# Altium project STM32F103Mini.PrjPcb
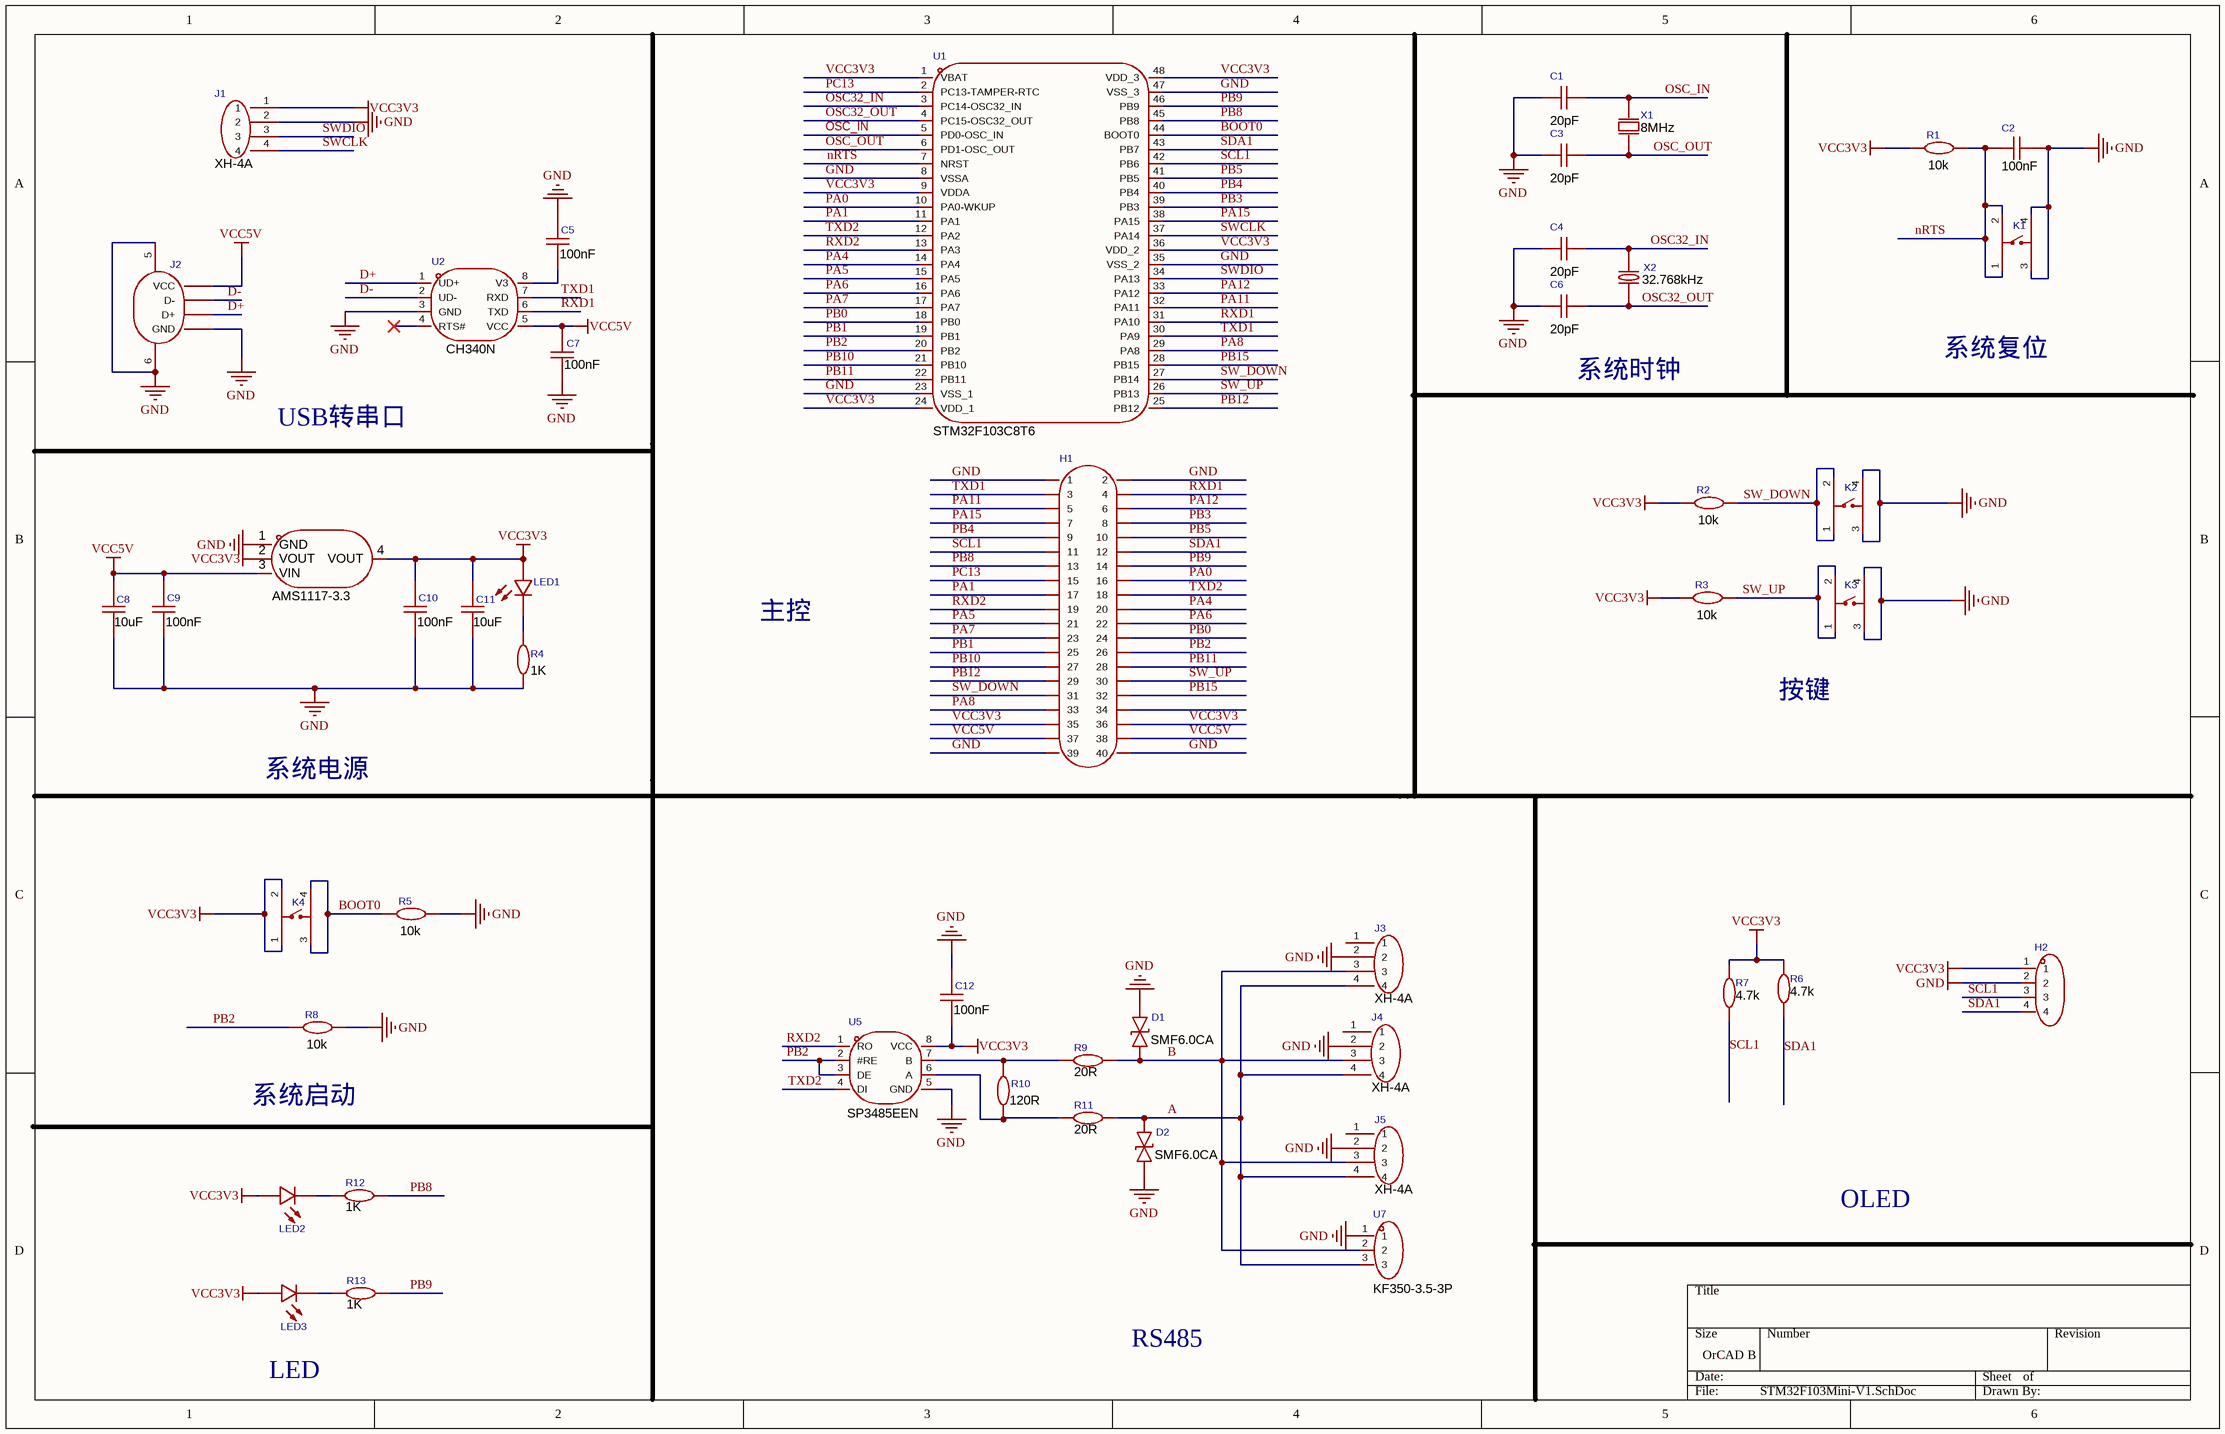
[diagram p0: STM32F103Mini-V1.SchDoc]
1 sheet, 48 parts. Net scope: global (net labels, ports and power ports of the same name join across sheets).
Board file: STM32F103Mini-260711.PcbDoc

## Sheet STM32F103Mini-V1.SchDoc
size OrCAD B; SheetNumber: 1; SheetTotal: 1

### Parts
C1  20pF  [C0603]
C2  100nF  [C0603]
C3  20pF  [C0603]
C4  20pF  [C0603]
C5  100nF  [C0603]
C6  20pF  [C0603]
C7  100nF  [C0603]
C8  10uF  [C0805]
C9  100nF  [C0603]
C10  100nF  [C0603]
C11  10uF  [C0805]
C12  100nF  [C0603]
D1  SMF6.0CA  [SOD-123FL_L2.8-W1.8-LS3.7-BI]
D2  SMF6.0CA  [SOD-123FL_L2.8-W1.8-LS3.7-BI]
H1  2.54mm 2*20p直排针  [HDR-TH_40P-P2.54-V-M-R2-C20-S2.54]  (value not drawn)
H2  pm254v-11-04-h85  [HDR-TH_4P-P2.54-V-F]  (value not drawn)
J1  XH-4A  [CONN-TH_4P-P2.50_XH-4A]
J2  921-111a1010d10200  [USB-B_TH_USB-B-FEMALE-90]  (value not drawn)
J3  XH-4A  [CONN-TH_4P-P2.50_XH-4A]
J4  XH-4A  [CONN-TH_4P-P2.50_XH-4A]
J5  XH-4A  [CONN-TH_4P-P2.50_XH-4A]
K1  kh-6x6x5h-stm  [SW-SMD_4P-L6.0-W6.0-P4.50-LS9.0_H5.0]  (value not drawn)
K2  kh-6x6x5h-stm  [SW-SMD_4P-L6.0-W6.0-P4.50-LS9.0_H5.0]  (value not drawn)
K3  kh-6x6x5h-stm  [SW-SMD_4P-L6.0-W6.0-P4.50-LS9.0_H5.0]  (value not drawn)
K4  kh-6x6x5h-stm  [SW-SMD_4P-L6.0-W6.0-P4.50-LS9.0_H5.0]  (value not drawn)
LED1  ncd0603c1  [LED0603-RD]  (value not drawn)
LED2  ncd0603c1  [LED0603-RD]  (value not drawn)
LED3  ncd0603c1  [LED0603-RD]  (value not drawn)
R1  10k  [R0603]
R2  10k  [R0603]
R3  10k  [R0603]
R4  1K  [R0603]
R5  10k  [R0603]
R6  4.7k  [R0603]
R7  4.7k  [R0603]
R8  10k  [R0603]
R9  20R  [R0805]
R10  120R  [R0603]
R11  20R  [R0805]
R12  1K  [R0603]
R13  1K  [R0603]
U1  STM32F103C8T6  [LQFP-48_L7.0-W7.0-P0.50-LS9.0-BL]
U2  CH340N  [SOP-8_L4.9-W3.9-P1.27-LS6.0-BL]
U5  SP3485EEN  [SOP-8_L5.0-W4.0-P1.27-LS6.0-BL]
U7  KF350-3.5-3P  [CONN-TH_3P-P3.50_KF350-3.5-3P]
X1  8MHz  [CRYSTAL-SMD_L5.0-W3.2]
X2  32.768kHz  [FC-135R_L3.2-W1.5]
  AMS1117-3.3  [SOT-223-3_L6.5-W3.4-P2.30-LS7.0-BR]

### Nets
GND: C1.1 C2.1 C3.1 C4.1 C5.2 C6.1 C8.1 C9.1 C10.1 C11.1 C12.2 D1.2 D2.1 H1.1 H1.2 H1.39 H1.40 H2.2 J1.2 J2.4(GND) J2.5(SH1) J2.6(SH2) J3.2 J4.2 J5.2 K1.3 K1.4 K2.3 K2.4 K3.3 K3.4 R4.1 R5.2 R8.2 U1.8(VSSA) U1.23(VSS_1) U1.35(VSS_2) U1.47(VSS_3) U2.3(GND) U5.5(GND) U7.1 .1(GND)
VCC3V3: C10.2 C11.2 C12.1 H1.35 H1.36 H2.1 J1.1 K4.1 K4.2 LED1.2(+) LED2.2(+) LED3.2(+) R1.1 R2.1 R3.1 R6.2 R7.2 U1.1(VBAT) U1.9(VDDA) U1.24(VDD_1) U1.36(VDD_2) U1.48(VDD_3) U5.8(VCC) .2(VOUT) .4(VOUT)
VCC5V: C7.1 C8.2 C9.2 H1.37 H1.38 J2.1(VCC) U2.5(VCC) .3(VIN)
A: D2.2 J3.4 J4.4 J5.4 R11.1 U7.3
B: D1.1 J3.3 J4.3 J5.3 R9.1 U7.2
BOOT0: K4.3 K4.4 R5.1 U1.44(BOOT0)
D+: J2.3(D+) U2.1(UD+)
D-: J2.2(D-) U2.2(UD-)
nRTS: C2.2 K1.1 K1.2 R1.2 U1.7(NRST)
OSC32_IN: C4.2 U1.3(PC14-OSC32_IN) X2.2
OSC32_OUT: C6.2 U1.4(PC15-OSC32_OUT) X2.1
OSC_IN: C1.2 U1.5(PD0-OSC_IN) X1.2(OSC2)
OSC_OUT: C3.2 U1.6(PD1-OSC_OUT) X1.1(OSC1)
PA0: H1.16 U1.10(PA0-WKUP)
PA1: H1.17 U1.11(PA1)
PA4: H1.20 U1.14(PA4)
PA5: H1.21 U1.15(PA5)
PA6: H1.22 U1.16(PA6)
PA7: H1.23 U1.17(PA7)
PA8: H1.33 U1.29(PA8)
PA11: H1.5 U1.32(PA11)
PA12: H1.6 U1.33(PA12)
PA15: H1.7 U1.38(PA15)
PB0: H1.24 U1.18(PB0)
PB1: H1.25 U1.19(PB1)
PB2: H1.26 R8.1 U1.20(PB2) U5.2(#RE) U5.3(DE)
PB3: H1.8 U1.39(PB3)
PB4: H1.9 U1.40(PB4)
PB5: H1.10 U1.41(PB5)
PB8: H1.13 R12.1 U1.45(PB8)
PB9: H1.14 R13.1 U1.46(PB9)
PB10: H1.27 U1.21(PB10)
PB11: H1.28 U1.22(PB11)
PB12: H1.29 U1.25(PB12)
PB15: H1.32 U1.28(PB15)
PC13: H1.15 U1.2(PC13-TAMPER-RTC)
RXD1: H1.4 U1.31(PA10) U2.6(TXD)
RXD2: H1.19 U1.13(PA3) U5.1(RO)
SCL1: H1.11 H2.3 R7.1 U1.42(PB6)
SDA1: H1.12 H2.4 R6.1 U1.43(PB7)
SW_DOWN: H1.31 K2.1 K2.2 R2.2 U1.27(PB14)
SW_UP: H1.30 K3.1 K3.2 R3.2 U1.26(PB13)
SWCLK: J1.4 U1.37(PA14)
SWDIO: J1.3 U1.34(PA13)
TXD1: H1.3 U1.30(PA9) U2.7(RXD)
TXD2: H1.18 U1.12(PA2) U5.4(DI)
NetC5_1: C5.1 U2.8(V3)
NetLED1_1: LED1.1(-) R4.2
NetLED2_1: LED2.1(-) R12.2
NetLED3_1: LED3.1(-) R13.2
NetR9_2: R9.2 R10.2 U5.7(B)
NetR10_1: R10.1 R11.2 U5.6(A)

Not connected (* = marked no-connect by the designer): C7 2; H1 34; J3 1; J4 1; J5 1; U2 4(RTS#)*

### Notes on the sheet
- 系统时钟
- 系统复位
- USB转串口
- 主控
- 按键
- 系统电源
- 系统启动
- OLED
- LED
- RS485
- Labels drawn without touching a wire or pin: GND

### Library data of the parts
C1 C3 C4 C6 = cl10c200jb8nnnc: 容值:20pF;精度:±5%;额定电压:50V;温度系数:C0G;; Manufacturer: SAMSUNG(三星); AddInBom: yes; ModelId: ac125912035d415993ca9572d50418b1; ModelName: C0603_L1.6-W0.8-H0.8; ModelTransform: 62.992,31.496,0,0,0,0,0,0,0; Tolerance: ±5%; Voltage Rating: 50V; Temperature Coefficient: C0G; Symbol: CL10C200JB8NNNC; LCSC Part Name: 20pF ±5% 50V; SupplierPart: C1648; ManufacturerPart: CL10C200JB8NNNC; Supplier Footprint: 0603; JLCPCB Part Class: Basic Part; Datasheet: https://item.szlcsc.com/datasheet/CL10C200JB8NNNC/2000.html; Supplier: LCSC; ConvertToPcb: yes; FootprintName: C0603; Value: 20pF
C2 C5 C7 C9 C10 C12 = cc0603krx7r9bb104: 容值:100nF;精度:±10%;额定电压:50V;温度系数:X7R;; Manufacturer: YAGEO(国巨); AddInBom: yes; ModelId: ac125912035d415993ca9572d50418b1; ModelName: C0603_L1.6-W0.8-H0.8; ModelTransform: 62.992,31.496,0,0,0,0,0,0,0; Tolerance: ±10%; Voltage Rating: 50V; Temperature Coefficient: X7R; Symbol: CC0603KRX7R9BB104; LCSC Part Name: 100nF ±10% 50V; SupplierPart: C14663; ManufacturerPart: CC0603KRX7R9BB104; Supplier Footprint: 0603; JLCPCB Part Class: Basic Part; Datasheet: https://item.szlcsc.com/datasheet/CC0603KRX7R9BB104/15331.html; Supplier: LCSC; ConvertToPcb: yes; FootprintName: C0603; Value: 100nF
C8 C11 = cl21a106kaynnne_c15850: 容值:10uF;精度:±10%;额定电压:25V;温度系数:X5R;; Manufacturer: SAMSUNG(三星); AddInBom: yes; ModelId: 1ba041120af144c991958decab20d241; ModelName: C0805_L2.0-W1.3-H1.3; ModelTransform: 78.74,51.181,0,0,0,0,0,0.0005,0; Tolerance: ±10%; Voltage Rating: 25V; Temperature Coefficient: X5R; Symbol: CL21A106KAYNNNE; LCSC Part Name: 10uF ±10% 25V; SupplierPart: C15850; ManufacturerPart: CL21A106KAYNNNE; Supplier Footprint: 0805; JLCPCB Part Class: Basic Part; Datasheet: https://item.szlcsc.com/datasheet/CL21A106KAYNNNE/16532.html; Supplier: LCSC; ConvertToPcb: yes; FootprintName: C0805; Value: 10uF
D1 D2 = smf6.0ca_c2990473: 极性:双向;反向截止电压(Vrwm):6V;钳位电压:10.3V;峰值脉冲电流(Ipp):19.4A;峰值脉冲功率(Ppp):200W;击穿电压:6.67V;; Manufacturer: Liown(里阳半导体); AddInBom: yes; ModelId: d105299b3871451c86f679efef28ff8f; ModelTransform: 145.669,70.866,0,0,0,0,0,0,0; Polarity: 双向; Reverse Stand-Off Voltage (Vrwm): 6V; Clamping Voltage: 10.3V; Peak Pulse Current (Ipp): 19.4A; Peak Pulse Power Dissipation (Ppp): 200W; Voltage - Breakdown: 6.67V; Reverse Leakage Current (Ir): 400uA; level of protection: IEC 61000-4-2; Type: TVS; Symbol: SMF6.0CA_C2990473; LCSC Part Name: 双向TVS 6V截止 峰值浪涌电流：19.4A; SupplierPart: C2990473; ManufacturerPart: SMF6.0CA; Supplier Footprint: SOD-123FL; JLCPCB Part Class: Extended Part; Datasheet: https://item.szlcsc.com/datasheet/SMF6.0CA/3449907.html; Supplier: LCSC; ConvertToPcb: yes; FootprintName: SOD-123FL_L2.8-W1.8-LS3.7-BI; ModelName: SOD-123FL_L2.8-W1.8-LS3.7-BI; Operating Temperature: -55℃~+150℃
H1 = 2.54mm 2*20p直排针: 插针结构:2x20P;间距:2.54mm;行距:2.54mm;圆针/方针:方针;安装方式:直插;排数:双排;总PIN位数:40P;额定电流:3A;额定电压:-;配合针长度:6mm;塑高:-;端接针长度:3mm;触头材质:黄铜;触头镀层:-;工作温度:-40℃~+105℃;颜色:黑色;; Manufacturer: BOOMELE(博穆精密); Symbol: Header-Male-2.54_2x20; AddInBom: yes; ModelId: 2f697d2f705a4509bdac70452e51b3cc; ModelName: HDR-TH_40P-P2.54-M-LI-2X20P; ModelTransform: 1999.996,196.85,0,0,0,0,0,0,-118.11; Pin Structure: 2x20P; Circluar Pins/Square Pins: 方针; Current Rating: 3A; LCSC Part Name: 2x20P 间距:2.54mm 方针 直插; SupplierPart: C50980; ManufacturerPart: 2.54mm 2*20P直排针; Supplier Footprint: 插件,P=2.54mm; JLCPCB Part Class: Extended Part; Datasheet: https://item.szlcsc.com/datasheet/2.54mm%25202*20P%25E7%259B%25B4%25E6%258E%2592%25E9%2592%2588/51992.html; Supplier: LCSC; ConvertToPcb: yes; FootprintName: HDR-TH_40P-P2.54-V-M-R2-C20-S2.54; Pitch: 2.54mm; Row Spacing: 2.54mm; Mounting Type: 直插; Number of Rows: 双排; Number of Pins: 40P; Voltage Rating (Max): -; Length of Mating Pin: 6mm; Insulation Height: -; Length of End Connection Pin: 3mm; Contact Material: 黄铜; Contact Plating: -; Operating Temperature: -40℃~+105℃; Color: 黑色
H2 = pm254v-11-04-h85: 插孔结构:1x4P;间距:2.54mm;行距:-;圆孔/方孔:方孔;安装方式:直插;排数:单排;总孔位数:4P;额定电流:3A;插孔方向:顶部;塑高:8.5mm;触头材质:黄铜;触头镀层:-;工作温度:-40℃~+105℃;; Manufacturer: XFCN(兴飞); AddInBom: yes; ModelId: d187812051054f85879fcaa51a310d8e; ModelTransform: 419.6842,98.464,0,0,0,0,0,0,-118.11; Holes Structure: 1x4P; Pitch: 2.54mm; Circular Hole / Square Hole: 方孔; Number of Positions: 4P; Current Rating: 3A; Holes Direction: 顶部; Symbol: PM254V-11-04-H85; LCSC Part Name: 1x4P 间距:2.54mm 直插; SupplierPart: C541851; ManufacturerPart: PM254V-11-04-H85; Supplier Footprint: 插件,P=2.54mm; JLCPCB Part Class: Extended Part; Datasheet: https://item.szlcsc.com/datasheet/PM254V-11-04-H85/562472.html; Supplier: LCSC; ConvertToPcb: yes; FootprintName: HDR-TH_4P-P2.54-V-F; ModelName: HDR-TH_4P-P2.54-V-F; Row Spacing: -; Mounting Type: 直插; Number of Rows: 单排; Insulation Height: 8.5mm; Contact Material: 黄铜; Contact Plating: -; Operating Temperature: -40℃~+105℃
J1 J3-J5 = xh-4a_c37815: 插针结构:1x4P;间距:2.5mm;安装方式:直插;参考系列:XH;总PIN数:4P;排数:1;每排PIN数:4;行距:-;额定电流:-;触头材质:-;触头镀层:-;工作温度:-;; Manufacturer: BOOMELE(博穆精密); AddInBom: yes; ModelId: 5fb049f4745545a5b3e6d8e7931866fa; ModelTransform: 492.125,224.409,0,180,0,0,0,17.913,-98.425; Pins Structure: 1x4P; Pitch: 2.5mm; Reference Series: XH; Number of PINs Per Row: 4; Z-Height of the Board: 7mm; X-Length of Bottom Edge on Board (Spacing Line): 12.5mm; Y-Width of Bottom Edge on Board: 5.8mm; Symbol: XH-4A; LCSC Part Name: 1x4P 间距:2.5mm 直插 系列:XH; SupplierPart: C37815; ManufacturerPart: XH-4A; Supplier Footprint: 插件,P=2.5mm; JLCPCB Part Class: Extended Part; Datasheet: https://item.szlcsc.com/datasheet/XH-4A/38795.html; Supplier: LCSC; ConvertToPcb: yes; FootprintName: CONN-TH_4P-P2.50_XH-4A; ModelName: CONN-TH_4P-P2.50_XH-4A; Mounting Type: 直插; Number of Pins: 4P; Number of Rows: 1; Row Spacing: -; Current Rating: -; Contact Material: -; Contact Plating: -; Operating Temperature: -; Voltage Rating: -; Plastic Material: -; Flame Retardant Rating: -; Supplementary Features: -; Color: 白色
J2 = 921-111a1010d10200: 连接器类型:Type-B;协议标准:USB 2.0;公母:母;安装方式:弯插;触点数量:4P;端口数量:1;; Manufacturer: 精拓金; Symbol: USB-B-Female-90; AddInBom: yes; ModelId: 427257db465a432d8a34b597c871403b; ModelTransform: 544.04938,649.605,0,0,0,0,-0.005,-175.199,-118.11; Connector Type: Type-B; Protocol Standard: USB 2.0; Gender: 母; Number of Contacts: 4P; Number of Ports: 1; Detection color: 白色; LCSC Part Name: Type-B 母 弯插; SupplierPart: C46392; ManufacturerPart: 921-111A1010D10200; Supplier Footprint: 插件; JLCPCB Part Class: Extended Part; Datasheet: https://item.szlcsc.com/datasheet/921-111A1010D10200/47396.html; Supplier: LCSC; ConvertToPcb: yes; FootprintName: USB-B_TH_USB-B-FEMALE-90; ModelName: USB-B_TH_USB-B-FEMALE-90; Mounting Type: 弯插; Length: 16.3mm
K1-K4 = kh-6x6x5h-stm: 电路结构:单刀单掷;按钮形状:圆形按钮;安装方式:立贴;开关长度:6mm;开关宽度:6mm;开关高度:5mm;带支架:不带支架;触点电流:50mA;额定电压:12V;工作寿命:8万次;; Manufacturer: kinghelm(金航标); AddInBom: yes; ModelId: 46371efb35684031937580a0045530ec; ModelTransform: 354.33,236.25937,0,0,0,0,0,0,0; Circuit: 单刀单掷; Actuator Style: 圆形按钮; Switch Height: 5mm; with Bracket: 不带支架; Contact Current: 50mA; Voltage Rating: 12V; Actuator/Cap Color: 黑色; Life: 8万次; Symbol: KH-6X6X5H-STM; LCSC Part Name: 6*6*5mm 立贴 轻触开关; SupplierPart: C2837531; ManufacturerPart: KH-6X6X5H-STM; Supplier Footprint: SMD-4P,6x6mm; JLCPCB Part Class: Extended Part; Datasheet: https://item.szlcsc.com/datasheet/KH-6X6X5H-STM/3009601.html; Supplier: LCSC; ConvertToPcb: yes; FootprintName: SW-SMD_4P-L6.0-W6.0-P4.50-LS9.0_H5.0; ModelName: SW-SMD_4P-L6.0-W6.0-P4.50-LS9.0_H5.0; Mounting Type: 立贴; Length: 6mm; Width: 6mm; Termination Style: 鸥翼型
LED1-LED3 = ncd0603c1: 灯头类型:-;发光颜色:黄绿色;正向压降(Vf):1.6V~2.6V;功率:65mW;正向电流:25mA;波长:565nm~578nm;二极管配置:独立二极管;透镜颜色:-;色温:-;发光强度:13mcd;发光角度:140°;载带方式:-;工作温度:-30℃~+85℃;; Manufacturer: 国星光电; Symbol: FC-D1608HGK-572C; AddInBom: yes; ModelId: 1f0d29a91be547639d425604e9b96ebb; ModelTransform: 63.7794,32.283,0,0,0,0,0,0,0; Illumination Color: 黄绿色; Power(Watts): 65mW; Forward Current: 25mA; Peak Wavelength: 576nm; Diode Configuration: 独立二极管; Luminous Intensity: 13mcd; Viewing Angle: 140°; LCSC Part Name: 片式发光二极管; SupplierPart: C84264; ManufacturerPart: NCD0603C1; Supplier Footprint: 0603; JLCPCB Part Class: Extended Part; Datasheet: https://item.szlcsc.com/datasheet/NCD0603C1/85433.html; Supplier: LCSC; ConvertToPcb: yes; FootprintName: LED0603-RD; ModelName: LED0603-RD; Lamp Holder Type: -; Voltage - Forward(Vf): 1.6V~2.6V; Wavelength - Dominant: 565nm~578nm; Lens Color: -; Color Temperature: -; Mounting Style: -; Operating Temperature: -30℃~+85℃
R1-R3 R5-R8 = 0603waf1002t5e: 电阻类型:厚膜电阻;阻值:10kΩ;精度:±1%;功率:100mW;工作电压:75V;温度系数:±100ppm/℃;; Manufacturer: UNI-ROYAL(厚声); AddInBom: yes; ModelId: fc143cca1e79419f9cd78b61e9279f08; ModelTransform: 31.8897,63.7794,0,90,0,0,0,0,0; Value: 10kΩ; Tolerance: ±1%; Power(Watts): 100mW; Voltage-Supply(Max): 75V; Symbol: 0603WAF1002T5E; LCSC Part Name: 厚膜电阻 10kΩ ±1% 100mW; SupplierPart: C25804; ManufacturerPart: 0603WAF1002T5E; Supplier Footprint: 0603; JLCPCB Part Class: Basic Part; Datasheet: https://item.szlcsc.com/datasheet/0603WAF1002T5E/26547.html; Supplier: LCSC; ConvertToPcb: yes; FootprintName: R0603; ModelName: R0603; Type: 厚膜电阻; Temperature Coefficient: ±100ppm/℃; Operating Temperature: -55℃~+155℃
R4 R12 R13 = 0603waf1001t5e: 电阻类型:厚膜电阻;阻值:1kΩ;精度:±1%;功率:100mW;工作电压:75V;温度系数:±100ppm/℃;; Manufacturer: UNI-ROYAL(厚声); AddInBom: yes; ModelId: fc143cca1e79419f9cd78b61e9279f08; ModelTransform: 31.8897,63.7794,0,90,0,0,0,0,0; Value: 1kΩ; Tolerance: ±1%; Power(Watts): 100mW; Voltage-Supply(Max): 75V; Symbol: 0603WAF1001T5E; LCSC Part Name: 1kΩ ±1% 100mW 厚膜电阻; SupplierPart: C21190; ManufacturerPart: 0603WAF1001T5E; Supplier Footprint: 0603; JLCPCB Part Class: Basic Part; Datasheet: https://item.szlcsc.com/datasheet/0603WAF1001T5E/21904.html; Supplier: LCSC; ConvertToPcb: yes; FootprintName: R0603; ModelName: R0603; Type: 厚膜电阻; Temperature Coefficient: ±100ppm/℃; Operating Temperature: -55℃~+155℃
R9 R11 = 0805w8f200jt5e: 电阻类型:厚膜电阻;阻值:20Ω;精度:±1%;功率:125mW;工作电压:150V;温度系数:±100ppm/℃;; Manufacturer: UNI-ROYAL(厚声); AddInBom: yes; ModelId: 37a81e68749a4138bd2dfa6897b24b85; ModelName: R0805_L2.0-W1.3-H0.6; ModelTransform: 78.74,51.181,0,0,0,0,0,-0.0005,0; Value: 20Ω; Tolerance: ±1%; Power(Watts): 125mW; Voltage-Supply(Max): 150V; Symbol: 0805W8F200JT5E; LCSC Part Name: 20Ω ±1% 125mW 厚膜电阻; SupplierPart: C17544; ManufacturerPart: 0805W8F200JT5E; Supplier Footprint: 0805; JLCPCB Part Class: Basic Part; Datasheet: https://item.szlcsc.com/datasheet/0805W8F200JT5E/18232.html; Supplier: LCSC; ConvertToPcb: yes; FootprintName: R0805; Type: 厚膜电阻; Temperature Coefficient: ±100ppm/℃; Operating Temperature: -55℃~+155℃
R10 = 0603waf1200t5e: 电阻类型:厚膜电阻;阻值:120Ω;精度:±1%;功率:100mW;工作电压:75V;温度系数:±100ppm/℃;; Manufacturer: UNI-ROYAL(厚声); AddInBom: yes; ModelId: fc143cca1e79419f9cd78b61e9279f08; ModelTransform: 31.8897,63.7794,0,90,0,0,0,0,0; Value: 120Ω; Tolerance: ±1%; Power(Watts): 100mW; Voltage-Supply(Max): 75V; Symbol: 0603WAF1200T5E; LCSC Part Name: 120Ω ±1% 100mW 厚膜电阻; SupplierPart: C22787; ManufacturerPart: 0603WAF1200T5E; Supplier Footprint: 0603; JLCPCB Part Class: Basic Part; Datasheet: https://item.szlcsc.com/datasheet/0603WAF1200T5E/23514.html; Supplier: LCSC; ConvertToPcb: yes; FootprintName: R0603; ModelName: R0603; Type: 厚膜电阻; Temperature Coefficient: ±100ppm/℃; Operating Temperature: -55℃~+155℃
U1 = stm32f103c8t6: CPU内核:ARM-M3;CPU最大主频:72MHz;应用领域:-;; Manufacturer: ST(意法半导体); AddInBom: yes; ModelId: 093be70396ff421eb2cdb946d5311efc; ModelName: LQFP-48_L7.0-W7.0-H1.4-LS9.0-P0.50; ModelTransform: 354.331,354.331,0,0,0,0,0,0,0; CPU Core: ARM-M3; CPU Maximum Speed: 72MHz; Program Storage Size: 64KB; Program Memory Type: FLASH; Number of I/O: 37; ADC (Bit): 12bit; Voltage - Supply: 2V~3.6V; Symbol: STM32F103C8T6; LCSC Part Name: 主流增强型ARM Cortex-M3 MCU，具有64 KB Flash、72 MHz CPU、电机控制、USB和CAN; SupplierPart: C8734; ManufacturerPart: STM32F103C8T6; Supplier Footprint: LQFP-48(7x7); JLCPCB Part Class: Extended Part; Datasheet: https://item.szlcsc.com/datasheet/STM32F103C8T6/9243.html; Supplier: LCSC; ConvertToPcb: yes; FootprintName: LQFP-48_L7.0-W7.0-P0.50-LS9.0-BL; Applications: -
U2 = ch340n: 应用功能:USB转串口;USB协议版本:USB 2.0;通道数:1;数据速率:2Mbps;; Manufacturer: WCH(南京沁恒); Symbol: CH340N_C2977777; AddInBom: yes; ModelId: 75c24a7891ee4dd6bdac16a7163ff87e; ModelName: SOP-8_L4.9-W3.9-P1.27-LS6.0-BL-1; ModelTransform: 192.913,236.22,0,0,0,0,-0.393,2.749,0; Applications Function: USB转串口; USB Protocol: USB 2.0; Number of Channels: 1; Voltage - Supply: 3.3V；5V; Data Rate: 2Mbps; LCSC Part Name: USB2.0芯片CH340; SupplierPart: C2977777; ManufacturerPart: CH340N; Supplier Footprint: SOP-8; JLCPCB Part Class: Extended Part; Datasheet: https://item.szlcsc.com/datasheet/CH340N/3390257.html; Supplier: LCSC; ConvertToPcb: yes; FootprintName: SOP-8_L4.9-W3.9-P1.27-LS6.0-BL; Operating Temperature: -20℃~+70℃; Features: 可编程波特率；内置时钟发生器；上电复位
U5 = sp3485een(umw): 类型:收发器;数据速率:12Mbps;; Manufacturer: UMW(友台半导体); AddInBom: yes; ModelId: a3315c1c78f949e6bb82c6eaca1c53c7; ModelName: SOP-8_L5.0-W4.0-H1.8-LS6.2-P1.27; ModelTransform: 244.094,196.85,0,90,0,0,0,0,0; Number of Drivers: 1; Voltage - Supply: 2.97V~3.63V; Data Rate: 12Mbps; Number of Nodes: 256; Supply Current (Iq): 520uA; Communication Mode: 半双工; Symbol: SP3485EEN; LCSC Part Name: SP3485E 3.3V电源，最多256个节点，12Mbps半双工，RS485/RS422收发器; SupplierPart: C668205; ManufacturerPart: SP3485EEN(UMW); Supplier Footprint: SOP-8; JLCPCB Part Class: Extended Part; Datasheet: https://item.szlcsc.com/datasheet/SP3485EEN(UMW)/698053.html; Supplier: LCSC; ConvertToPcb: yes; FootprintName: SOP-8_L5.0-W4.0-P1.27-LS6.0-BL; Type: 收发器; Number of Receivers: 1; Operating Temperature: -40℃~+85℃
U7 = kf350-3.5-3p: 结构:1x3P;间距:3.5mm;颜色:绿色;安装方式:直插;排数:1;每排PIN数:3;额定电流:10A;额定电压:300V;线规 - AWG:18~24;线规 - 平方毫米:0.75;工作温度:-40℃~+105℃;; Manufacturer: KEFA(科发); AddInBom: yes; ModelId: 66d6ea4170124c3f83d623ee30815f83; ModelTransform: 444.881,271.653,0,0,0,0,-0.005,1.969,-137.795; Number of Positions or Pins: 1x3P; Pitch: 3.5mm; Number of PINs Per Row: 3; Current Rating: 10A; Voltage Rating (Max): 300V; Wire Gauge - AWG: 18~24; Wire Gauge - mm2: 0.75; Symbol: KF350-3.5-3P; LCSC Part Name: 1x3P 3.5mm 直插 排数:1 每排P数:3; SupplierPart: C474893; ManufacturerPart: KF350-3.5-3P; Supplier Footprint: 插件,P=3.5mm; JLCPCB Part Class: Extended Part; Datasheet: https://item.szlcsc.com/datasheet/KF350-3.5-3P/481511.html; Supplier: LCSC; ConvertToPcb: yes; FootprintName: CONN-TH_3P-P3.50_KF350-3.5-3P; ModelName: CONN-TH_3P-P3.50_KF350-3.5-3P; Color: 绿色; Mounting Type: 直插; Number of Pins: 3P; Number of Rows: 1; Operating Temperature: -40℃~+105℃
X1 = x50328msb2gi: 晶振类型:贴片晶振;频率:8MHz;常温频差:±10ppm;负载电容:20pF;频率稳定度:±20ppm;; Manufacturer: YXC(扬兴晶振); AddInBom: yes; ModelId: d7c39c66443246ff83c2003c1e1eb6f1; ModelTransform: 196.85,125.984,0,0,0,0,0,0,0; Normal temperature Frequency Tolerance: ±10ppm; Load Capacitance: 20pF; Frequency Stability: ±20ppm; Symbol: X50328MSB2GI; LCSC Part Name: YSX530GA 8MHZ 2P 5032 20PF ±10PPM -40~85℃ (±20PPM); SupplierPart: C115962; ManufacturerPart: X50328MSB2GI; Supplier Footprint: SMD5032-2P; JLCPCB Part Class: Basic Part; Datasheet: https://item.szlcsc.com/datasheet/X50328MSB2GI/117214.html; Supplier: LCSC; ConvertToPcb: yes; FootprintName: CRYSTAL-SMD_L5.0-W3.2; ModelName: CRYSTAL-SMD_L5.0-W3.2; Type: 贴片晶振; Value: 8MHz; Operating Temperature: -40℃~+85℃
X2 = q13fc13500004_c32346: 晶振类型:贴片晶振;频率:32.768kHz;常温频差:±20ppm;负载电容:12.5pF;; Manufacturer: EPSON(爱普生); Symbol: Q13FC1350000400; AddInBom: yes; ModelId: 751105e878f044059ef0ee72de95f96e; ModelTransform: 125.984,59.055,0,0,0,0,0,0,0; Normal temperature Frequency Tolerance: ±20ppm; Load Capacitance: 12.5pF; Equivalent Series Resistance(ESR): 70kΩ; LCSC Part Name: 32.768kHz ±20ppm 12.5pF; SupplierPart: C32346; ManufacturerPart: Q13FC13500004; Supplier Footprint: SMD3215-2P; JLCPCB Part Class: Basic Part; Datasheet: https://item.szlcsc.com/datasheet/Q13FC13500004/33310.html; Supplier: LCSC; ConvertToPcb: yes; FootprintName: FC-135R_L3.2-W1.5; ModelName: FC-135R_L3.2-W1.5; Type: 贴片晶振; Value: 32.768kHz; Operating Temperature: -40℃~+85℃
 = ams1117-3.3_c6186: 输出极性:正极;工作电压:15V;输出电压:3.3V;输出电流:1A;电源纹波抑制比(PSRR):72dB@(120Hz);输出类型:固定;; Manufacturer: Advanced Monolithic Systems; AddInBom: yes; ModelId: 925194bf9823436183a3e0b978a8d076; ModelName: SOT-223-4P_L6.5-W3.5-H1.6-LS7.0-P2.30; ModelTransform: 279.89794,255.905,0,180,0,0,-3.9385,-0.0005,0; Output Configuration: 正极; Voltage - Supply: 15V; Output Voltage: 3.3V; Output Current: 1A; Voltage Dropout: 1.1V@(800mA); standby current: 5mA; Noise: 0.003%Vout; Output Type: 固定; Number of Outputs: 1